# Altium schematic sheet Connectors.SchDoc
size A
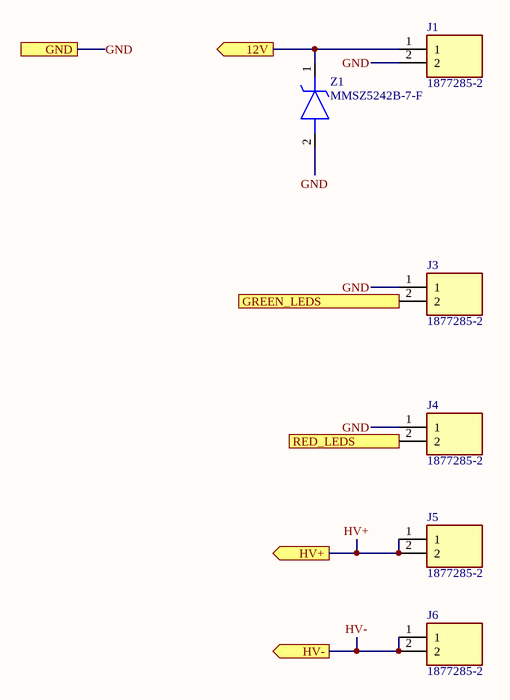
[diagram p0: Connectors.SchDoc]

## Parts
J1  1877285-2  [18772852]
J3  1877285-2  [18772852]
J4  1877285-2  [18772852]
J5  1877285-2  [18772852]
J6  1877285-2  [18772852]
Z1  MMSZ5242B-7-F  [SOD3716X145N]

## Ports
12V (out), GND, GREEN_LEDS (in), HV+ (out), HV- (out), RED_LEDS (in)

## Nets
12V: J1.1 Z1.1(K) ; port 12V
GND: J1.2 J3.1 J4.1 Z1.2(A) ; port GND
GREEN_LEDS: J3.2 ; port GREEN_LEDS
HV+: J5.1 J5.2 ; port HV+
HV-: J6.1 J6.2 ; port HV-
RED_LEDS: J4.2 ; port RED_LEDS

## Library data of the parts
J1 J3-J6 = 1877285-2: Connector; Manufacturer_Name: TE Connectivity; Datasheet Link: https://www.te.com/commerce/DocumentDelivery/DDEController?Action=srchrtrv&DocNm=7-1773458-5_ECONOMY_POWER_QRG&DocType=Data%20Sheet&DocLang=English&PartCntxt=1877285-2&DocFormat=pdf; Height: 12mm; Manufacturer_Part_Number: 1877285-2; Mouser Part Number: 571-1877285-2; Mouser Price/Stock: https://www.mouser.co.uk/ProductDetail/TE-Connectivity/1877285-2?qs=ka3zfMQDmFlAIZq5pDt5JA%3D%3D; Arrow Part Number: 1877285-2; Arrow Price/Stock: https://www.arrow.com/en/products/1877285-2/te-connectivity?region=europe
Z1 = MMSZ5242B-7-F: Zener Diode; Manufacturer_Name: Diodes Incorporated; Datasheet Link: https://www.diodes.com//assets/Datasheets/ds18010.pdf; Height: 1.45mm; Manufacturer_Part_Number: MMSZ5242B-7-F; Mouser Part Number: 621-MMSZ5242B-F; Mouser Price/Stock: https://www.mouser.co.uk/ProductDetail/Diodes-Incorporated/MMSZ5242B-7-F?qs=q1%252B6u8LlB5fEENM1dXHh%252Bg%3D%3D; Arrow Part Number: MMSZ5242B-7-F; Arrow Price/Stock: https://www.arrow.com/en/products/mmsz5242b-7-f/diodes-incorporated?utm_currency=USD&region=nac